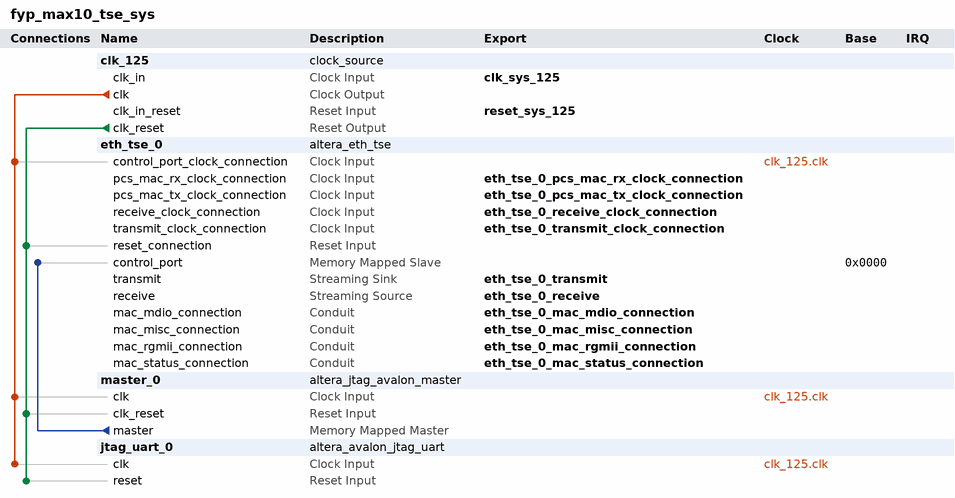
[diagram p0: system contents]
# Platform Designer (Qsys) system fyp_max10_tse_sys, MAX 10 10M50DAF484C6GES
# Parameters at their usual value, and those the tool derives, are not listed.
package require -exact qsys 18.1
create_system fyp_max10_tse_sys
set_project_property DEVICE_FAMILY {MAX 10}
set_project_property DEVICE 10M50DAF484C6GES

add_instance clk_125 clock_source 18.1
set_instance_parameter_value clk_125 clockFrequency 125000000

add_instance eth_tse_0 altera_eth_tse 18.1
set_instance_parameter_value eth_tse_0 XCVR_RCFG_JTAG_ENABLE 0
set_instance_parameter_value eth_tse_0 XCVR_SET_CAPABILITY_REG_ENABLE 0
set_instance_parameter_value eth_tse_0 XCVR_SET_CSR_SOFT_LOGIC_ENABLE 0
set_instance_parameter_value eth_tse_0 XCVR_SET_PRBS_SOFT_LOGIC_ENABLE 0
set_instance_parameter_value eth_tse_0 XCVR_SET_USER_IDENTIFIER 0
set_instance_parameter_value eth_tse_0 core_variation MAC_ONLY
set_instance_parameter_value eth_tse_0 eg_addr 9
set_instance_parameter_value eth_tse_0 enable_gmii_loopback true
set_instance_parameter_value eth_tse_0 enable_hd_logic true
set_instance_parameter_value eth_tse_0 enable_mac_flow_ctrl true
set_instance_parameter_value eth_tse_0 enable_magic_detect true
set_instance_parameter_value eth_tse_0 enable_shift16 true
set_instance_parameter_value eth_tse_0 ifGMII RGMII
set_instance_parameter_value eth_tse_0 ing_addr 9
set_instance_parameter_value eth_tse_0 mdio_clk_div 40
set_instance_parameter_value eth_tse_0 stat_cnt_ena true
set_instance_parameter_value eth_tse_0 transceiver_type NONE

add_instance master_0 altera_jtag_avalon_master 18.1

add_instance jtag_uart_0 altera_avalon_jtag_uart 18.1
set_instance_parameter_value jtag_uart_0 simInteractiveOptions NO_INTERACTIVE_WINDOWS

# connections
add_connection clk_125.clk eth_tse_0.control_port_clock_connection clock
add_connection clk_125.clk jtag_uart_0.clk clock
add_connection clk_125.clk master_0.clk clock
add_connection clk_125.clk_reset eth_tse_0.reset_connection reset
add_connection clk_125.clk_reset jtag_uart_0.reset reset
add_connection clk_125.clk_reset master_0.clk_reset reset
add_connection master_0.master eth_tse_0.control_port avalon
set_connection_parameter_value master_0.master/eth_tse_0.control_port baseAddress 0x0000

# exported interfaces
add_interface clk_sys_125 clock sink
set_interface_property clk_sys_125 EXPORT_OF clk_125.clk_in
add_interface eth_tse_0_mac_mdio_connection conduit end
set_interface_property eth_tse_0_mac_mdio_connection EXPORT_OF eth_tse_0.mac_mdio_connection
add_interface eth_tse_0_mac_misc_connection conduit end
set_interface_property eth_tse_0_mac_misc_connection EXPORT_OF eth_tse_0.mac_misc_connection
add_interface eth_tse_0_mac_rgmii_connection conduit end
set_interface_property eth_tse_0_mac_rgmii_connection EXPORT_OF eth_tse_0.mac_rgmii_connection
add_interface eth_tse_0_mac_status_connection conduit end
set_interface_property eth_tse_0_mac_status_connection EXPORT_OF eth_tse_0.mac_status_connection
add_interface eth_tse_0_pcs_mac_rx_clock_connection clock sink
set_interface_property eth_tse_0_pcs_mac_rx_clock_connection EXPORT_OF eth_tse_0.pcs_mac_rx_clock_connection
add_interface eth_tse_0_pcs_mac_tx_clock_connection clock sink
set_interface_property eth_tse_0_pcs_mac_tx_clock_connection EXPORT_OF eth_tse_0.pcs_mac_tx_clock_connection
add_interface eth_tse_0_receive avalon_streaming source
set_interface_property eth_tse_0_receive EXPORT_OF eth_tse_0.receive
add_interface eth_tse_0_receive_clock_connection clock sink
set_interface_property eth_tse_0_receive_clock_connection EXPORT_OF eth_tse_0.receive_clock_connection
add_interface eth_tse_0_transmit avalon_streaming sink
set_interface_property eth_tse_0_transmit EXPORT_OF eth_tse_0.transmit
add_interface eth_tse_0_transmit_clock_connection clock sink
set_interface_property eth_tse_0_transmit_clock_connection EXPORT_OF eth_tse_0.transmit_clock_connection
add_interface reset_sys_125 reset sink
set_interface_property reset_sys_125 EXPORT_OF clk_125.clk_in_reset

set_interconnect_requirement {$system} qsys_mm.clockCrossingAdapter HANDSHAKE
set_interconnect_requirement {$system} qsys_mm.enableEccProtection FALSE
set_interconnect_requirement {$system} qsys_mm.insertDefaultSlave FALSE
set_interconnect_requirement {$system} qsys_mm.maxAdditionalLatency 1

save_system fyp_max10_tse_sys.qsys
